# Altium schematic sheet Input_Filter.SchDoc
size A4; SheetNumber: 2; SheetTotal: 9
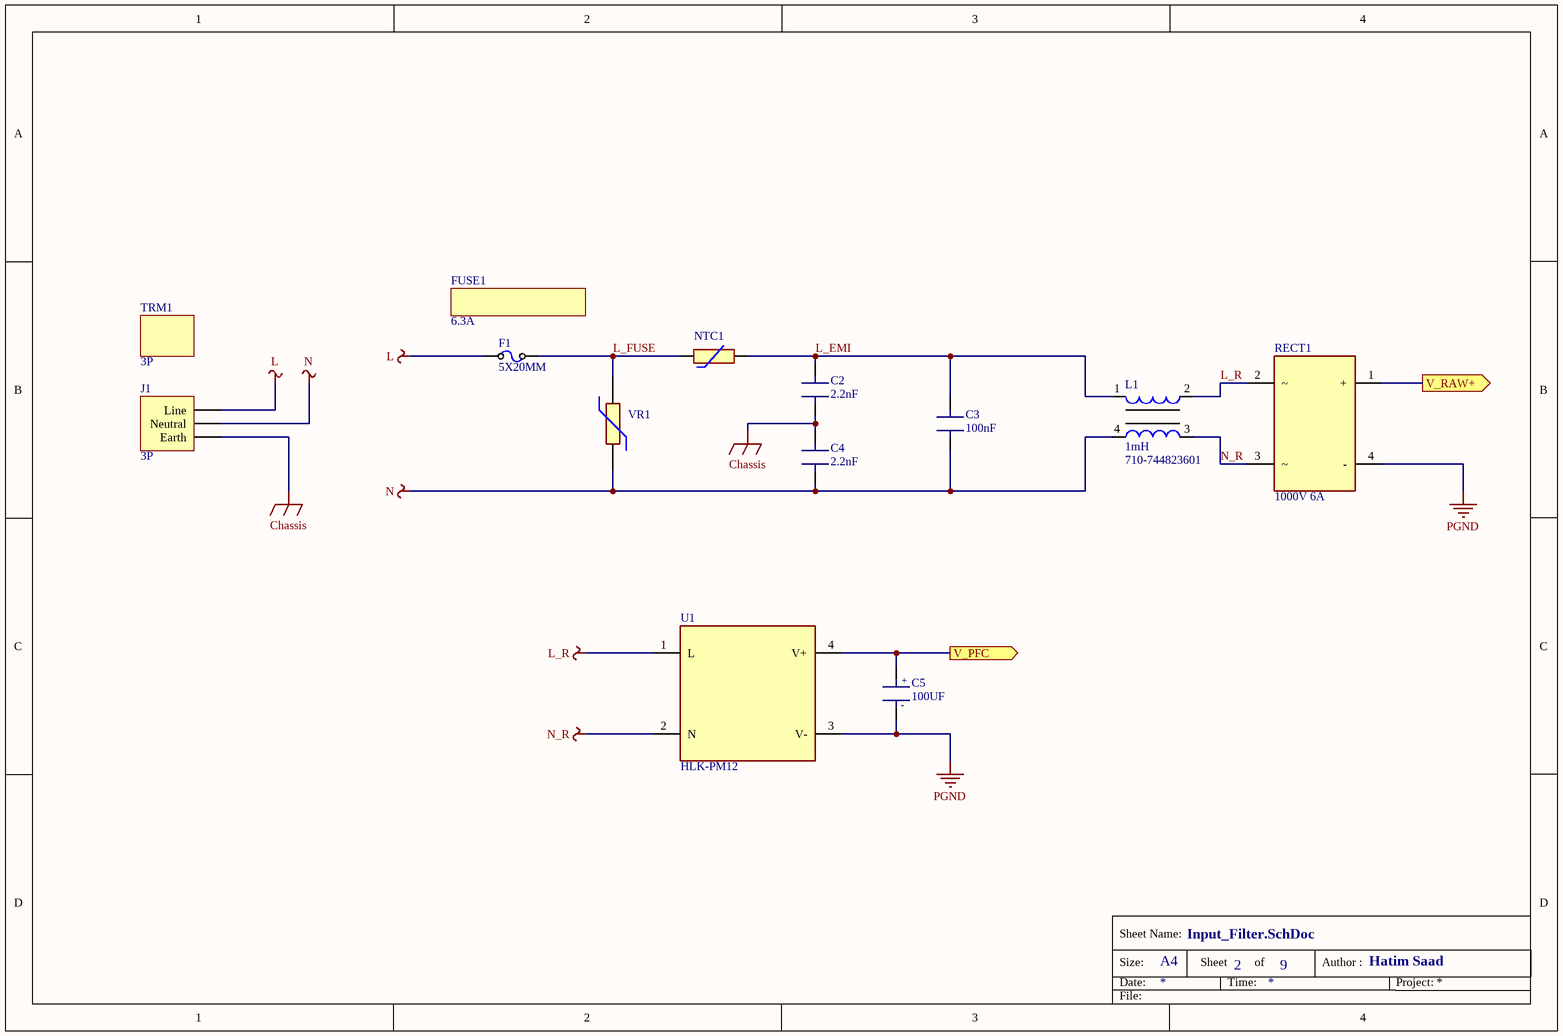
[diagram p0: Input_Filter.SchDoc]

## Parts
C2  2.2nF  [CAP: 10MM Ceramic Disc]
C3  100nF  [CAP: 15MM Film Capacitor]
C4  2.2nF  [CAP: 10MM Ceramic Disc]
C5  100UF  [CAP SMD 8]
F1  5X20MM  [FUSE HOLDER 5X20MM]
FUSE1  6.3A  (mechanical)
J1  3P  [691313510003]
L1  1mH  Supplier Part Number 1: 710-744823601  [744823601]
NTC1  BN-LG15Y6R0MYB  [NTC Radial: 7.5X1MM]  (value not drawn)
RECT1  1000V 6A  [TBSG-4]
TRM1  3P  (mechanical)
U1  HLK-PM12  [HLK-PM01]
VR1  275VAC  [B72307S0271K101]  (value not drawn)

## Ports
V_PFC (out), V_RAW+ (out)

## Nets
Chassis: C2.1(A) C4.2(B) J1.3(Earth)
L: F1.1 J1.1(Line)
L_R: L1.2 RECT1.2 U1.1(L)
N: C3.1(A) C4.1(A) J1.2(Neutral) L1.4 VR1.1
N_R: L1.3 RECT1.3 U1.2(N)
PGND: C5.2(-) RECT1.4(-) U1.3(V-)
L_EMI: C2.2(B) C3.2(B) L1.1 NTC1.2
L_FUSE: F1.2 NTC1.1 VR1.2
V_PFC: C5.1(+) U1.4(V+) ; port V_PFC
V_RAW+: RECT1.1(+) ; port V_RAW+

## Notes on the sheet
- Size:
- Date:
- Sheet Name:
- A4
- Sheet
- Time:
- of
- Author :
- Hatim Saad
- Project:
- File:

## Library data of the parts
C2 C4 = VY1222M43Y5UC63V0: Safety Capacitors 2200pF X760 Y500VAC 20% Y5U; Supplier 1: Mouser; Supplier Part Number 1: 72-VY1222M43Y5UC63V0
C3 = R46KI310050M1M: Safety Capacitors 275vac 0.1uF 20%; Supplier 1: Mouser; Supplier Part Number 1: 80-R46KI310050M1M
C5 = EDK107M050A9MAA: Aluminium Electrolytic Capacitors - SMD 50V 100uF 20%; Supplier 1: Mouser; Supplier Part Number 1: 80-EDK107M050A9MAA
F1 = 0PTF0078P: Fuse Holder 5X20MM Pitch 22/7 UL94V0 Open; Supplier 1: Mouser; Supplier Part Number 1: 576-0PTF0078P
FUSE1 = 0034.3125: Cartridge Fuses FST 5X20 250V 6.3A; Supplier 1: Mouser; Supplier Part Number 1: 693-0034.3125
J1 = 691313510003: Pluggable Terminal Blocks WR-TBL 300VAC 20A 3P Right Angle; Supplier 1: Mouser; Supplier Part Number 1: 710-691313510003
L1 = 744823601: Common Mode Chokes / Filters WE-CMB Choke Type M 1mH 6A 13mOhm; Supplier 1: Mouser
NTC1 = BN-LG15Y6R0MYB: NTC (Negative Temperature Coefficient) Thermistors 15 dia Power NTC 6ohm Y kink bulk; Supplier 1: Mouser; Supplier Part Number 1: 652-BN-LG15Y6R0MYB
RECT1 = TBSA60M-TP: Bridge Rectifiers BRIDGE RECTIFIERS 1000V 6A, TBSG; Supplier 1: Mouser; Supplier Part Number 1: 833-TBSA60M-TP
TRM1 = 691351500003: Pluggable Terminal Blocks WR-TBL 300VAC 20A 3P Right Angle; Supplier 1: Mouser; Supplier Part Number 1: 710-691351500003
U1 = HLK-PM12: AC-DC Module 3W 220Vac to 12Vdc; Supplier 1: LCSC; Supplier Part Number 1: C209905
VR1 = B72307S0271K101: Varistors 7mm, 275Vac, 10%, Compact Series; Supplier 1: Mouser; Supplier Part Number 1: 871-B72307S0271K101